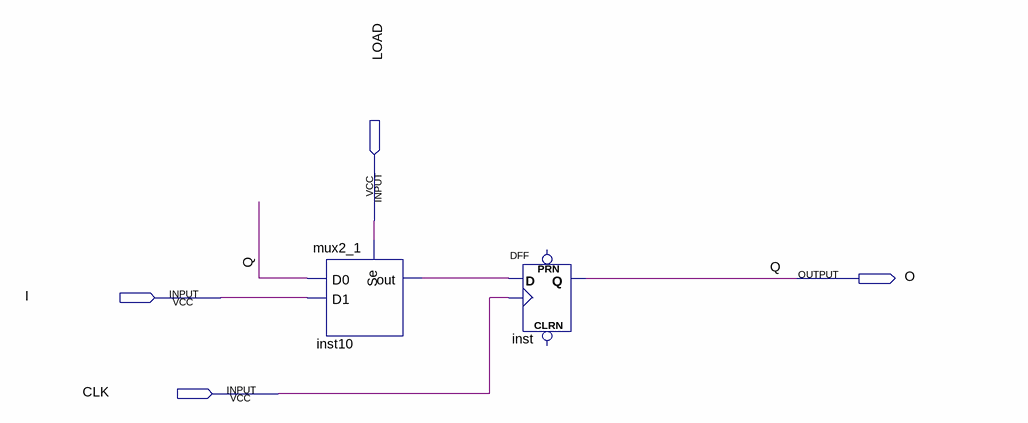
[diagram p0: schematic sheet]
// Quartus schematic reg_1b.bdf as structural Verilog: 2 symbols, 4 pins
module reg_1b (
  input  LOAD,
  input  I,
  input  CLK,
  output O
);

  wire inst10_out;

  mux2_1 inst10 (.D0(O), .D1(I), .Se(LOAD), .out(inst10_out));
  DFF inst (.CLK(CLK), .D(inst10_out), .Q(O));  // open: CLRN, PRN

  // Other names for the same wires on the sheet: Q = O
endmodule
